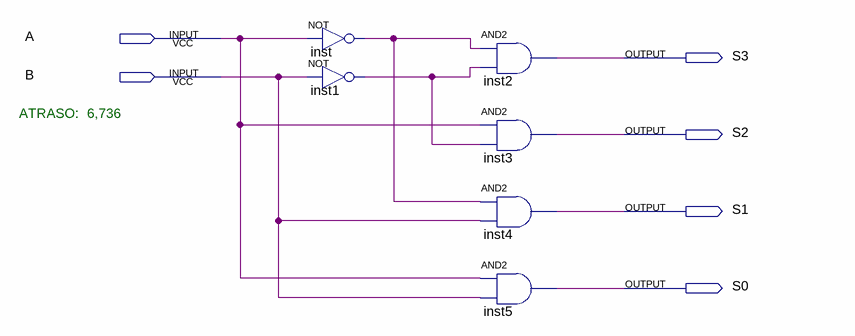
[diagram p0: schematic sheet]
// Quartus schematic decoder2_4.bdf as structural Verilog: 6 symbols, 6 pins
module decoder2_4 (
  input  A,
  input  B,
  output S3,
  output S2,
  output S1,
  output S0
);

  wire inst1_out, inst_out;

  not inst (inst_out, A);
  not inst1 (inst1_out, B);
  and inst2 (S3, inst_out, inst1_out);
  and inst3 (S2, A, inst1_out);
  and inst4 (S1, inst_out, B);
  and inst5 (S0, A, B);

  // Notes on the sheet:
  //   ATRASO:  6,736
endmodule
